# Altium project ESE516_ExampleBaseProject_V1.PrjPcb
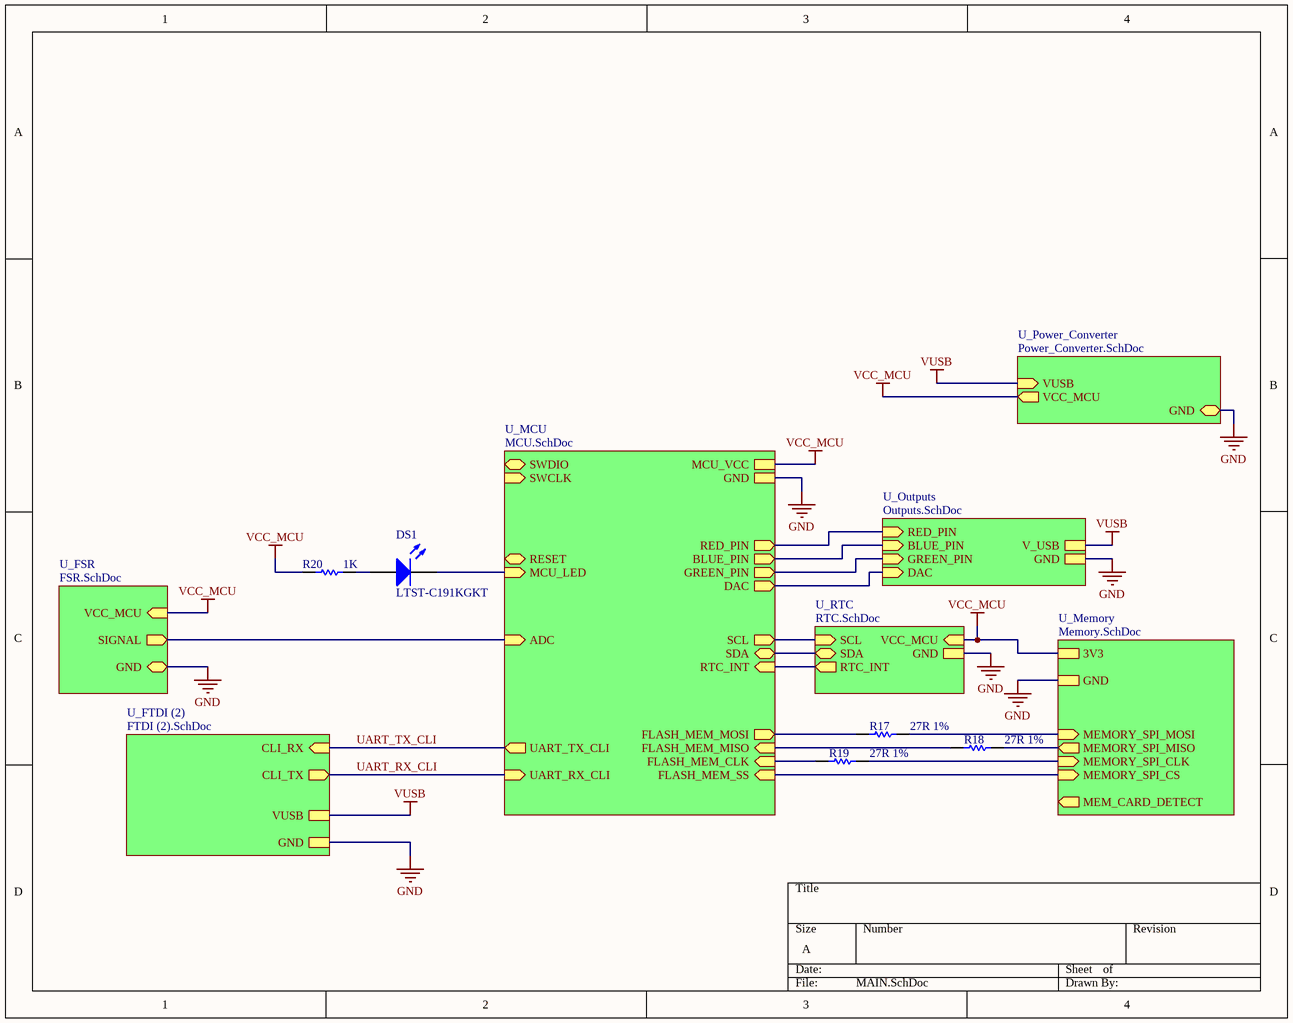
[diagram p0: MAIN.SchDoc]
8 sheets, 99 parts. Net scope: strictly hierarchical (ports join the sheet entries above them; power ports are local).
Board file: ESE516_BareBoardTemplate.PcbDoc
Sheets:
  MAIN.SchDoc
    U_MCU = MCU.SchDoc
    U_Memory = Memory.SchDoc
    U_RTC = RTC.SchDoc
    U_Outputs = Outputs.SchDoc
    U_Power_Converter = Power_Converter.SchDoc
    U_FSR = FSR.SchDoc
    U_FTDI (2) = FTDI (2).SchDoc

## Sheet MAIN.SchDoc
size A; DrawnBy: Eduardo

### Parts
DS1  LTST-C191KGKT  [LITE-ON-LTST-C191KRKT-2_V]
R17  27R 1%  [RESC0603(1608)_N]
R18  27R 1%  [RESC0603(1608)_N]
R19  27R 1%  [RESC0603(1608)_N]
R20  1K  [RESC0603(1608)_M]

### Sub-sheets
U_FSR = FSR.SchDoc: VCC_MCU (in), SIGNAL (out), GND (bidir)
U_FTDI (2) = FTDI (2).SchDoc: CLI_RX (in), CLI_TX (out), VUSB, GND
U_MCU = MCU.SchDoc: SWDIO (bidir), SWCLK (in), UART_TX_CLI (out), UART_RX_CLI (in), FLASH_MEM_SS (in), FLASH_MEM_CLK (in), FLASH_MEM_MISO (in), FLASH_MEM_MOSI (out), RESET (bidir), MCU_LED (in), MCU_VCC, GND, SDA (bidir), SCL (out), DAC (out), RED_PIN (out), GREEN_PIN (out), BLUE_PIN (out), ADC (in), RTC_INT (in)
U_Memory = Memory.SchDoc: MEMORY_SPI_MOSI (in), MEMORY_SPI_MISO (out), MEMORY_SPI_CLK (in), MEMORY_SPI_CS (in), MEM_CARD_DETECT (out), GND, 3V3
U_Outputs = Outputs.SchDoc: RED_PIN (in), BLUE_PIN (in), GREEN_PIN (in), DAC (in), V_USB, GND
U_Power_Converter = Power_Converter.SchDoc: VUSB (in), VCC_MCU (out), GND (bidir)
U_RTC = RTC.SchDoc: SCL (in), RTC_INT (out), SDA (bidir), VCC_MCU (in), GND

### Nets
GND: sheet U_MCU/GND, sheet U_Memory/GND, sheet U_RTC/GND, sheet U_Outputs/GND, sheet U_Power_Converter/GND, sheet U_FSR/GND, sheet U_FTDI (2)/GND
VCC_MCU: R20.1 ; sheet U_MCU/MCU_VCC, sheet U_Memory/3V3, sheet U_RTC/VCC_MCU, sheet U_Power_Converter/VCC_MCU, sheet U_FSR/VCC_MCU
VUSB: sheet U_Outputs/V_USB, sheet U_Power_Converter/VUSB, sheet U_FTDI (2)/VUSB
ADC: sheet U_MCU/ADC, sheet U_FSR/SIGNAL
BLUE_PIN: sheet U_MCU/BLUE_PIN, sheet U_Outputs/BLUE_PIN
DAC: sheet U_MCU/DAC, sheet U_Outputs/DAC
FLASH_MEM_SPI_SS: sheet U_MCU/FLASH_MEM_SS, sheet U_Memory/MEMORY_SPI_CS
GREEN_PIN: sheet U_MCU/GREEN_PIN, sheet U_Outputs/GREEN_PIN
MCU_LED: DS1.2(K) ; sheet U_MCU/MCU_LED
MEM_SPI_CLK: R19.2 ; sheet U_Memory/MEMORY_SPI_CLK
MEM_SPI_MISO: R18.2 ; sheet U_Memory/MEMORY_SPI_MISO
MEM_SPI_MOSI: R17.2 ; sheet U_Memory/MEMORY_SPI_MOSI
RED_PIN: sheet U_MCU/RED_PIN, sheet U_Outputs/RED_PIN
RTC_INT: sheet U_MCU/RTC_INT, sheet U_RTC/RTC_INT
SCL: sheet U_MCU/SCL, sheet U_RTC/SCL
SDA: sheet U_MCU/SDA, sheet U_RTC/SDA
SERCOM1_PAD2_SPI_MISO: R18.1 ; sheet U_MCU/FLASH_MEM_MISO
SERCOM1_PAD2_SPI_MOSI: R17.1 ; sheet U_MCU/FLASH_MEM_MOSI
SERCOM1_PAD3_SPI_SCK: R19.1 ; sheet U_MCU/FLASH_MEM_CLK
UART_RX_CLI: sheet U_MCU/UART_RX_CLI, sheet U_FTDI (2)/CLI_TX
UART_TX_CLI: sheet U_MCU/UART_TX_CLI, sheet U_FTDI (2)/CLI_RX
NetDS1_1: DS1.1(A) R20.2

### Library data of the parts
DS1 = CMP-2000-05198-1: Chip LED, Green, 574 nm, 40 pF, -55 to 85 degC, 2-Pin SMD, RoHS, Tape and Reel; Manufacturer: Lite-On; Rad Hardened: No; Emitting Color: YellowGreen; Product Height (mm): 0.55mm; Forward Voltage: 2.4V; Number of Elements: 1; Dominant Wave Length: 571nm; DELETED: Compliant; Viewing Angle: 130deg; High Brightness: Yes; Peak Wavelength: 574nm; Type: Uni-Color; Forward Current: 30mA; Product Length (mm): 1.6mm; Luminous Intensity: 35mcd; Test Current (It): 20mA; Chip Material: AlGaInP; Product Depth (mm): 0.8mm; Shape Type: Rectangular; Reverse Voltage: 5V; Power Dissipation: 75W; Pin Count: 2; Lens Dimensions: 1.1X0.8X0.37mm; Packaging: TapeandReel; Main Category: ChipLED; Operating Temperature Classification: Industrial; Package Type: ChipLed; Mounting: SurfaceMount; Lum Intensity: 35mcd; Operating Temp Range: -55Cto85C; Datasheet Version: Jan-07; Datasheet URL: http://download.siliconexpert.com/pdfs/2007/08/26/semi_b/manual/lot/ds/ltst-c191kgkt.pdf; Manufacturer URL: http://www.us.liteon.com/
R17-R19 = CMP-1012-00331-1: 27R 0.1W 1% 0603 (1608 Metric)  SMD; Case-EIA: 0603; Value: 27.00 Ohm; Case-Metric: 1608; Technology: SMT; Tolerance: 1 %; Power: 0.1 W
R20 = CMP-1012-00510-1: 1K 0.1W 1% 0603 (1608 Metric)  SMD; Case-Metric: 1608; Case-EIA: 0603; Value: 1000.00 Ohm; Technology: SMT; Tolerance: 1 %; Power: 0.1 W

## Sheet MCU.SchDoc
size A
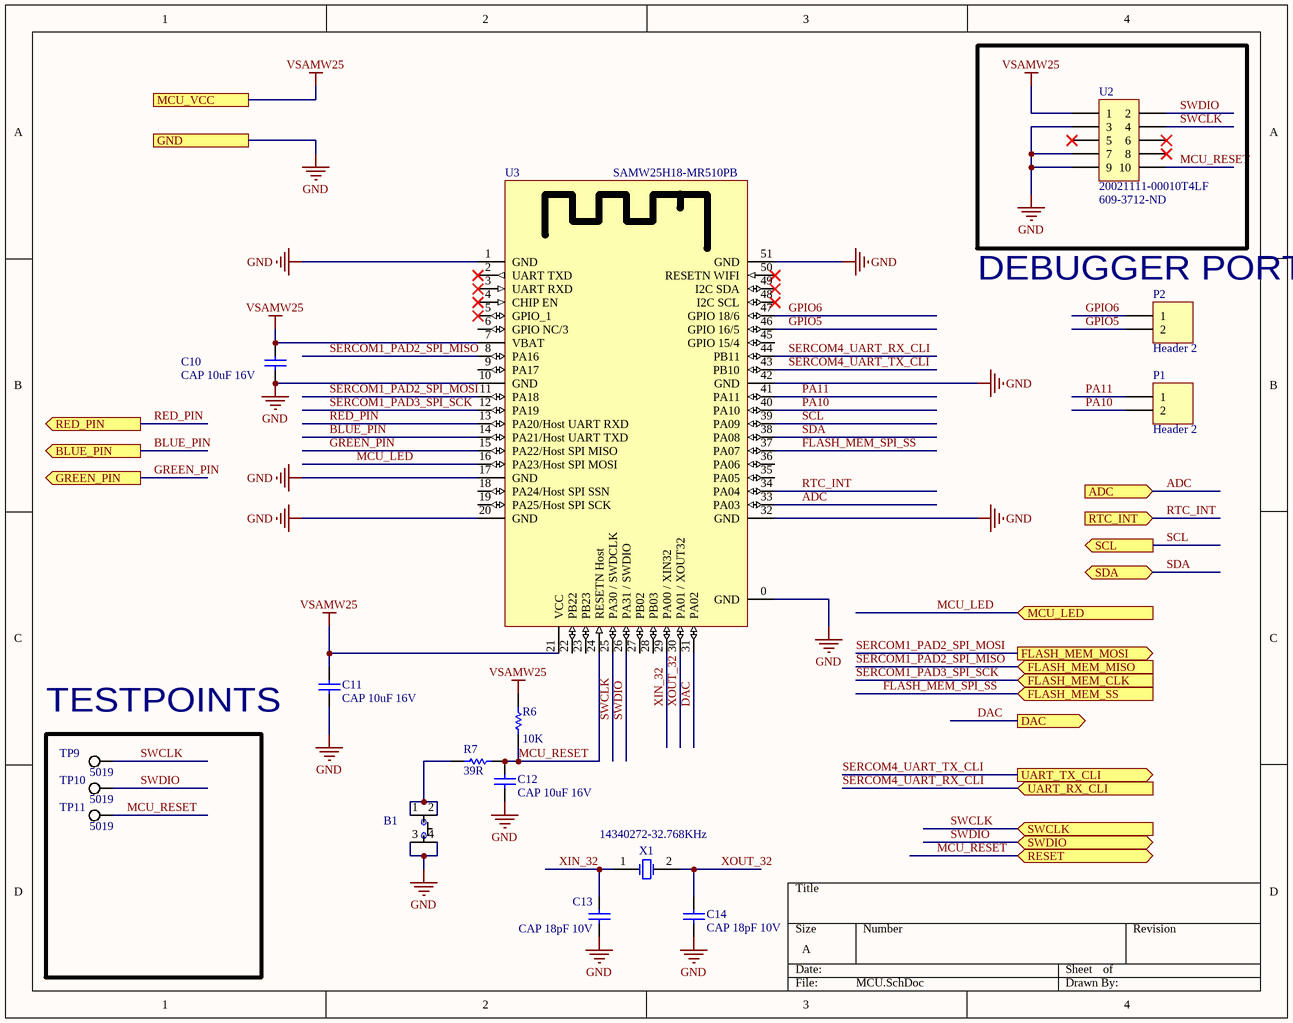
[diagram p1: MCU.SchDoc]

### Parts
B1  PTS810 SJK 250 SMTR LFS  [PTS810 SJK 250 SMTR LFS]  (value not drawn)
C10  CAP 10uF 16V  [CAPC0805(2012)145_L]
C11  CAP 10uF 16V  [CAPC0805(2012)145_L]
C12  CAP 10uF 16V  [CAPC0805(2012)145_L]
C13  CAP 18pF 10V  [CAPC0805(2012)75_L]
C14  CAP 18pF 10V  [CAPC0805(2012)75_L]
P1  Header 2  [HDR1X2]  (no BOM)
P2  Header 2  [HDR1X2]  (no BOM)
R6  value 10K  [J1-0603]
R7  39R  [RESC0805(2012)_N]
TP9  5019  [KSTN-5019_V]  (no BOM)
TP10  5019  [KSTN-5019_V]  (no BOM)
TP11  5019  [KSTN-5019_V]  (no BOM)
U2  20021111-00010T4LF  Supplier Part Number 1: 609-3712-ND  [20021111-00010T4LF]
U3  SAMW25H18-MR510PB  [SAMW25H18-MR510PB]
X1  14340272-32.768KHz  [ITTI-14340272-32.768KHz-2_V]

### Blocks framed on the sheet
TESTPOINTS: TP9-TP11

### Ports
ADC (in), BLUE_PIN (out), DAC (out), FLASH_MEM_CLK (in), FLASH_MEM_MISO (in), FLASH_MEM_MOSI (out), FLASH_MEM_SS (in), GND, GREEN_PIN (out), MCU_LED (in), MCU_VCC, RED_PIN (out), RESET (bidir), RTC_INT (in), SCL (out), SDA (bidir), SWCLK (in), SWDIO (bidir), UART_RX_CLI (in), UART_TX_CLI (out)

### Nets
GND: B1.3 B1.4 C10.1 C11.1 C12.1 C13.2 C14.2 U2.3 U2.7 U2.9 U3.0(GND) U3.1(GND) U3.10(GND) U3.17(GND) U3.20(GND) U3.32(GND) U3.42(GND) U3.51(GND) ; port GND
VSAMW25: C10.2 C11.2 R6.2 U2.1 U3.7(VBAT) U3.21(VCC) ; port MCU_VCC  [project net VCC_MCU]
ADC: U3.33(PA03) ; port ADC
BLUE_PIN: U3.14(PA21/Host_UART_TXD) ; port BLUE_PIN
DAC: U3.31(PA02) ; port DAC
FLASH_MEM_SPI_SS: U3.37(PA07) ; port FLASH_MEM_SS
GPIO5: P2.2 U3.46(GPIO_16/5)
GPIO6: P2.1 U3.47(GPIO_18/6)
GREEN_PIN: U3.15(PA22/Host_SPI_MISO) ; port GREEN_PIN
MCU_LED: U3.16(PA23/Host_SPI_MOSI) ; port MCU_LED
MCU_RESET: C12.2 R6.1 R7.1 TP11.1 U2.10 U3.24(RESETN_Host) ; port RESET
PA10: P1.2 U3.40(PA10)
PA11: P1.1 U3.41(PA11)
RED_PIN: U3.13(PA20/Host_UART_RXD) ; port RED_PIN
RTC_INT: U3.34(PA04) ; port RTC_INT
SCL: U3.39(PA09) ; port SCL
SDA: U3.38(PA08) ; port SDA
SERCOM1_PAD2_SPI_MISO: U3.8(PA16) ; port FLASH_MEM_MISO
SERCOM1_PAD2_SPI_MOSI: U3.11(PA18) ; port FLASH_MEM_MOSI
SERCOM1_PAD3_SPI_SCK: U3.12(PA19) ; port FLASH_MEM_CLK
SERCOM4_UART_RX_CLI: U3.44(PB11) ; port UART_RX_CLI  [project net UART_RX_CLI]
SERCOM4_UART_TX_CLI: U3.43(PB10) ; port UART_TX_CLI  [project net UART_TX_CLI]
SWCLK: TP9.1 U2.4 U3.25(PA30_/_SWDCLK) ; port SWCLK
SWDIO: TP10.1 U2.2 U3.26(PA31_/_SWDIO) ; port SWDIO
XIN_32: C13.1 U3.29(PA00_/_XIN32) X1.1(X1)
XOUT_32: C14.1 U3.30(PA01_/_XOUT32) X1.2(X2)
NetB1_1: B1.1 B1.2 R7.2

Not connected (* = marked no-connect by the designer): U2 5* 6* 8*; U3 2(UART_TXD)* 3(UART_RXD)* 4(CHIP_EN)* 5(GPIO_1)* 6(GPIO_NC/3) 9(PA17) 18(PA24/Host_SPI_SSN) 19(PA25/Host_SPI_SCK) 22(PB22) 23(PB23) 27(PB02) 28(PB03) 35(PA05) 36(PA06) 45(GPIO_15/4) 48(I2C_SCL)* 49(I2C_SDA)* 50(RESETN_WIFI)*

### Notes on the sheet
- (near P2) DEBUGGER PORT

### Library data of the parts
B1 = PTS810 SJK 250 SMTR LFS: SWITCH TACTILE SPST-NO 0.05A 16V Tactile Switch SPST-NO Top Actuated Surface Mount; Manufacturer: ITT /  C&K Components; Part # Aliases: Y97LT25B5DBFP; Operating Force: 2.6 N; Actuator: Oval; Current Rating: 50 mA; Voltage Rating DC: 16 VDC; Contact Form: SPST; Switch Function: OFF - (ON); Mounting Direction: Straight; Stem Height: 2.5 mm; Brand: C&K Components; Travel: 0.15 mm; Manufacturer Part Number: PTS810SJK250SMTRLFS; Product Category: Tactile Switches; RoHS: Details; Termination Style: J Form Lead; Mounting Style: SMD/SMT; Color: White; Packaging: Reel; Contact Plating: Silver; Operating Temperature Range: - 40 C to + 85 C; Series: PTS810; Factory Pack Quantity: 2900; ComponentLink1URL: https://datasheet.ciiva.com/18514/pts810-4mar13-18514061.pdf; ComponentLink1Description: https://datasheet.ciiva.com/18514/pts810-4mar13-18514061.pdf; ComponentLink2URL: https://datasheet.ciiva.com/18514/pts810-4mar13-18514062.pdf; ComponentLink2Description: https://datasheet.ciiva.com/18514/pts810-4mar13-18514062.pdf; ComponentLink3URL: https://datasheet.ciiva.com/18514/pts810-4mar13-18514063.pdf; ComponentLink3Description: https://datasheet.ciiva.com/18514/pts810-4mar13-18514063.pdf; Supplier 1: Digi-Key; Supplier Part Number 1: CKN10503CT-ND
C10-C12 = CMP-1036-04927-1: CAP 10uF 16V ±10% 0805 (2012 Metric) Thickness 1.45mm SMD; Case-EIA: 0805; Tolerance: Â±10%; Case-Metric: 2012; Rated Voltage: 16 V; Technology: SMT; Value: 10uF; Max Thickness: 1.45 mm
C13 C14 = CMP-1036-01106-1: CAP 18pF 10V ±1% 0805 (2012 Metric) Thickness 0.75mm SMD; Tolerance: Â±1%; Case-Metric: 2012; Case-EIA: 0805; Technology: SMT; Rated Voltage: 10 V; Value: 18pF; Max Thickness: 0.75 mm
P1 P2 = Header 2: Header, 2-Pin; LatestRevisionDate: 17-Jul-2002; LatestRevisionNote: Re-released for DXP Platform.; Publisher: Altium Limited
R6 = Res1: Resistor; Published: 8-Jun-2000; LatestRevisionDate: 17-Jul-2002; LatestRevisionNote: Re-released for DXP Platform.; PackageReference: AXIAL-0.3; Publisher: Altium Limited; PackageDescription: Axial Device, Thru-Hole; 2 Leads; 0.3 in Pin Spacing
R7 = CMP-1013-00040-1: 39R 0.125W 5% 0805 (2012 Metric)  SMD; Value: 39.00 Ohm; Case-EIA: 0805; Case-Metric: 2012; Technology: SMT; Power: 0.125 W; Tolerance: 5 %
TP9-TP11 = CMP-1672-00008-1: Test Point, 1 Position SMD, RoHS, Tape and Reel; ComponentLink1Description: Manufacturer URL; Package Quantity: 1000; DatasheetVersion: 03/2014; Packaging: Tape and Reel; ComponentLink2URL: http://www.keyelco.com/product-pdf.cfm?p=1357; ComponentLink1URL: http://www.keyelco.com/; Mount: Surface Mount; Contact Plating: Silver; PackageDescription: 1-Pin Surface Mount Device, Body 3.81 x 2.03 mm; Pins: 1; RoHSCompliant: True; Mounting Technology: Surface Mount; ComponentLink2Description: Datasheet; PackageReference: 5019
U2 = 20021111-00010T4LF: CONN HEADER 10POS UNSHD VERT T/H; Manufacturer: Amphenol / FCI; Stack Height: 2.5 mm; Number of Positions / Contacts: 10; Brand: FCI; Pitch: 1.27 mm; Mounting Angle: Vertical; Current Rating: 10 A; Mating Post Length: 3.05 mm; Voltage Rating: 125 V; Manufacturer Part Number: 20021111-00010T4LF; Mounting Style: Through Hole; Product Category: Headers & Wire Housings; RoHS: Details; Series: Minitek; Product Type: Headers; Type: Unshrouded; Number of Positions: 10; Number of Rows: 2; Contact Plating: Gold; Housing Material: Plastic; Termination Style: Through Hole; Contact Material: Nickel; Packaging: Tube; Factory Pack Quantity: 93; Termination Post Length: 2.3 mm; ComponentLink1URL: https://datasheet.ciiva.com/1433/1079612-1433267.pdf; ComponentLink1Description: https://datasheet.ciiva.com/1433/1079612-1433267.pdf; ComponentLink2URL: https://datasheet.ciiva.com/409/20021111-409158.pdf; ComponentLink2Description: https://datasheet.ciiva.com/409/20021111-409158.pdf; ComponentLink3URL: https://datasheet.ciiva.com/5131/20021111-5131386.pdf; ComponentLink3Description: https://datasheet.ciiva.com/5131/20021111-5131386.pdf; ComponentLink4URL: https://datasheet.ciiva.com/9465/20021111-9465402.pdf; ComponentLink4Description: https://datasheet.ciiva.com/9465/20021111-9465402.pdf; Supplier 1: Digi-Key
U3 = SAMW25H18-MR510PB: RF TXRX MODULE WIFI TRACE ANT; Manufacturer: Atmel; Manufacturer Part Number: ATSAMW25H18-MR510PB; Protocol: 802.11b/g/n; Frequency: 2.4GHz; Data Rate: 65Mbps; Power - Output: 17dBm; Sensitivity: -95.5dBm; Serial Interfaces: SPI, UART; Antenna Type: Integrated, Trace; Memory Size: 256kB Flash, 32kB SRAM; Voltage - Supply: 2.7 V ~ 4.2 V; Category: RF/IF and RFID; Family: RF Transceiver Modules; Series: Xplained Pro; Packaging: Tray; RF Family/Standard: WiFi; Modulation: -; Current - Receiving: -; Current - Transmitting: -; Mounting Type: Surface Mount; Operating Temperature: -40°C ~ 85°C; Package / Case: Module; ComponentLink1URL: http://www.atmel.com/devices/ATSAMW25.aspx; ComponentLink1Description: http://www.atmel.com/devices/ATSAMW25.aspx; ComponentLink2URL: http://www.farnell.com/datasheets/1965115.pdf; ComponentLink2Description: http://www.farnell.com/datasheets/1965115.pdf; Supplier 1: Digikey; Stock 1: 120; Pricing 1: 1=19.14 (USD); Supplier Part Number 1: ATSAMW25H18-MR510PB-ND
X1 = CMP-0463-00001-2: Crystal, 32.768 KHz, -40 to 85 degC, 3.2 x 1.5 x 0.9 mm SMD; Manufacturer: ITTI; Load Capacitance: 12.5 pF; Frequency Tolerance: +/-20 ppm; Drive Level: 1 max. uw; Nominal Frequency: 32.768KHz; Mounting Technology: Surface Mount; Operating temperature: -40 to 85 degC; PartNumber: 14340272-32.768KHz; ComponentLink1URL: http://www.itti-co.com; ComponentLink1Description: Manufacturer URL; PackageReference: 14340272-32.768KHz-2; PackageDescription: 2-Pin Hand Drawn, Body 3.2 x 1.5mm, Pitch 2.5 mm

## Sheet Memory.SchDoc
size A
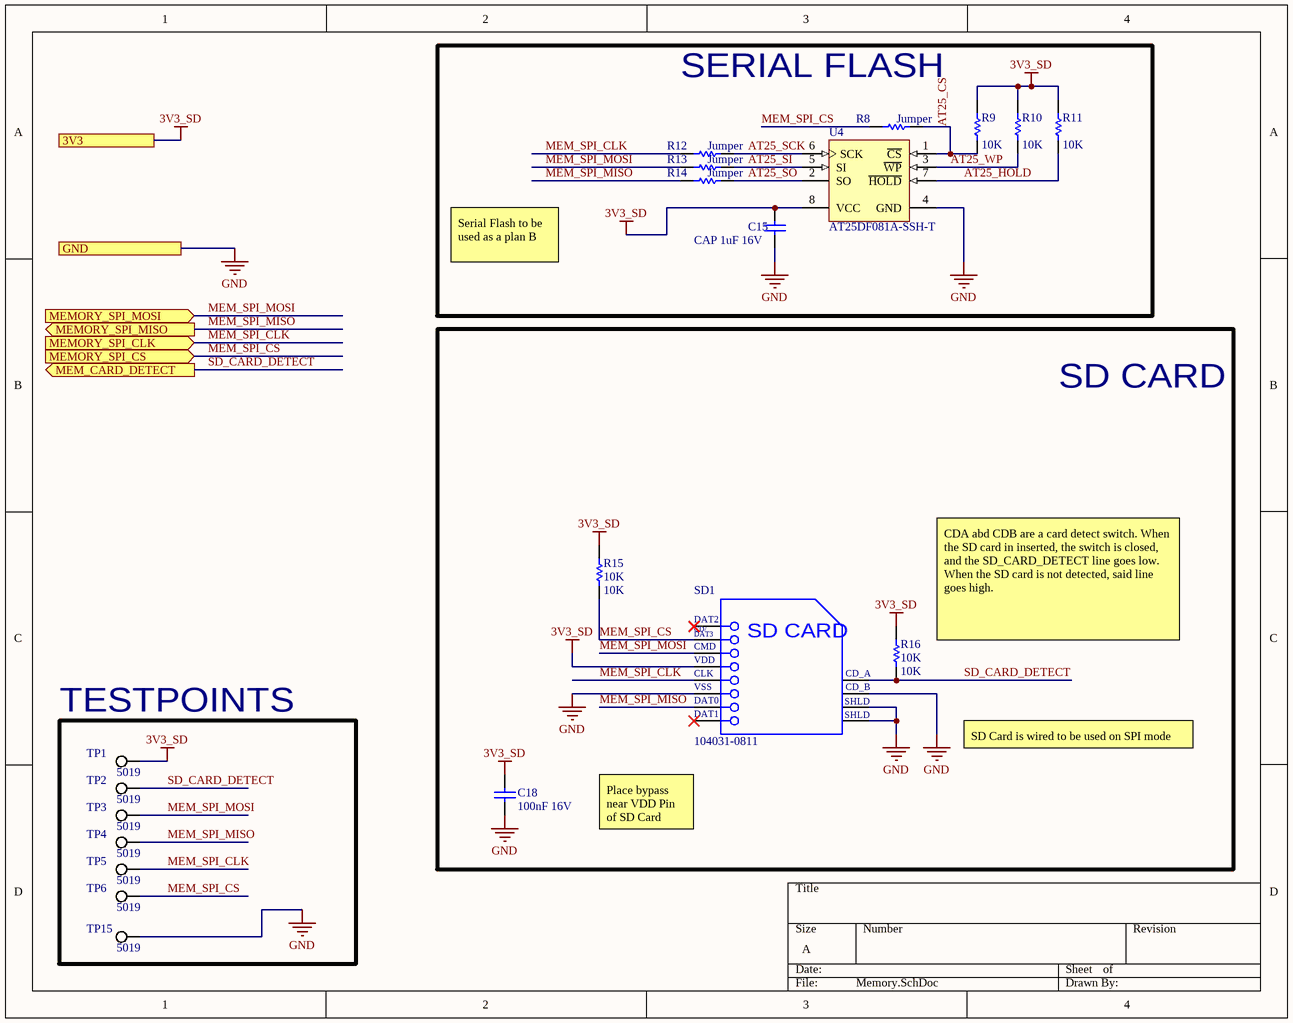
[diagram p2: Memory.SchDoc]

### Parts
C15  CAP 1uF 16V  [CAPC0603(1608)100_N]
C18  100nF 16V  [CAPC0603(1608)100_N]
R8  Jumper  [RESC0603(1608)_N]
R9  value 10K  [J1-0603]
R10  value 10K  [J1-0603]
R11  value 10K  [J1-0603]
R12  Jumper  [RESC0603(1608)_N]
R13  Jumper  [RESC0603(1608)_N]
R14  Jumper  [RESC0603(1608)_N]
R15  10K  [J1-0603]
R16  10K  [J1-0603]
SD1  104031-0811  [MOLX-104031-0811_V]
TP1  5019  [KSTN-5019_V]  (no BOM)
TP2  5019  [KSTN-5019_V]  (no BOM)
TP3  5019  [KSTN-5019_V]  (no BOM)
TP4  5019  [KSTN-5019_V]  (no BOM)
TP5  5019  [KSTN-5019_V]  (no BOM)
TP6  5019  [KSTN-5019_V]  (no BOM)
TP15  5019  [KSTN-5019_V]  (no BOM)
U4  AT25DF081A-SSH-T  [AT25DF081A-SSH-T]

### Blocks framed on the sheet
SERIAL FLASH: C15 R8-R14 U4
SD CARD: C18 R15 R16 SD1
TESTPOINTS: TP1-TP6 TP15

### Ports
3V3, GND, MEM_CARD_DETECT (out), MEMORY_SPI_CLK (in), MEMORY_SPI_CS (in), MEMORY_SPI_MISO (out), MEMORY_SPI_MOSI (in)

### Nets
3V3_SD: C15.2 C18.2 R9.2 R10.2 R11.2 R15.2 R16.2 SD1.4(VDD) TP1.1 U4.8(VCC) ; port 3V3  [project net VCC_MCU]
GND: C15.1 C18.1 SD1.6(VSS2) SD1.10(CD_B) SD1.11(SHLD1) SD1.12(SHLD2) TP15.1 U4.4(GND) ; port GND
AT25_CS: R8.2 R9.1 U4.1(~{CS})
AT25_HOLD: R11.1 U4.7(~{HOLD})
AT25_SCK: R12.2 U4.6(SCK)
AT25_SI: R13.2 U4.5(SI)
AT25_SO: R14.2 U4.2(SO)
AT25_WP: R10.1 U4.3(~{WP})
MEM_SPI_CLK: R12.1 SD1.5(CLK) TP5.1 ; port MEMORY_SPI_CLK
MEM_SPI_CS: R8.1 R15.1 SD1.2(CMD) TP6.1 ; port MEMORY_SPI_CS  [project net FLASH_MEM_SPI_SS]
MEM_SPI_MISO: R14.1 SD1.7(DAT0) TP4.1 ; port MEMORY_SPI_MISO
MEM_SPI_MOSI: R13.1 SD1.3(VSS1) TP3.1 ; port MEMORY_SPI_MOSI
SD_CARD_DETECT: R16.1 SD1.9(CD_A) TP2.1 ; port MEM_CARD_DETECT

Not connected (* = marked no-connect by the designer): SD1 1(CD/DAT3)* 8(DAT1)*

### Notes on the sheet
- Serial Flash to be used as a plan B
- (near R16) CDA abd CDB are a card detect switch. When the SD card in inserted, the switch is closed, and the SD_CARD_DETECT line goes low. When the SD card is not detected, said line goes high.
- SD Card is wired to be used on SPI mode
- Place bypass near VDD Pin of SD Card
- (in symbol CMP-2000-05825-1) DAT2; CD/; DAT3; SD CARD; VSS; SHLD

### Library data of the parts
C15 = CMP-1035-02737-1: CAP 1uF 16V ±10% 0603 (1608 Metric) Thickness 1mm SMD; Case-Metric: 1608; Tolerance: Â±10%; Case-EIA: 0603; Rated Voltage: 16 V; Max Thickness: 1 mm; Technology: SMT; Value: 1uF
C18 = CMP-1035-02584-1: CAP 100nF 16V ±10% 0603 (1608 Metric) Thickness 1mm SMD; Tolerance: Â±10%; Case-EIA: 0603; Case-Metric: 1608; Technology: SMT; Max Thickness: 1 mm; Value: 100nF; Rated Voltage: 16 V
R8 R12-R14 = CMP-1012-00001-1: Jumper 0603 (1608 Metric); Case-Metric: 1608; Value: 0.00 Ohm; Power: None; Case-EIA: 0603; Technology: SMT; Tolerance: None
R9-R11 R15 R16 = Res1: Resistor; Published: 8-Jun-2000; LatestRevisionDate: 17-Jul-2002; LatestRevisionNote: Re-released for DXP Platform.; PackageReference: AXIAL-0.3; Publisher: Altium Limited; PackageDescription: Axial Device, Thru-Hole; 2 Leads; 0.3 in Pin Spacing
  R15 R16: Value: 10K
SD1 = CMP-2000-05825-1: Micro SD Card, RA, -25 to 85 degC, 8-Pin SMD, RoHS, Tape and Reel; Voltage Rating: 10VAC/DC; Number of Contacts: 8; Insertion - Extraction Style: Push-Pull; Pitch: 1.1mm; Mating Cycles: 10000; Brand: Molex; Current Rating: 500mA; Manufacturer URL: http://www.molex.com/; Card Type: microSD; Mounting Type: Standard; Height: 1.42mm; Mounting Technology: SurfaceMount; Contact Plating: Gold; Product Category: MemoryCardConnectors; Package Description: 8-Pin Surface Mount Device, Body 11.95 x 11.4 mm, Pitch 1.1 mm; Datasheet URL: http://www.molex.com/pdm_docs/sd/1040310811_sd.pdf; Termination Style: SMD; Length: 11.4mm; Housing Material: LiquidCrystalPolymer(LCP); Orientation: RightAngle; RoHS: True; Contact Material: PhosphorBronze; Datasheet Version: Rev. E, 04/2006; Packaging: Reel; Manufacturer: Molex; Series: 104031; Product: CardConnectors; Number of Rows: 1Row; Package Reference: 104031-0811
TP1-TP6 TP15 = CMP-1672-00008-1: as TP9 on sheet MCU; ComponentLink1Description: Manufacturer URL; Package Quantity: 1000; DatasheetVersion: 03/2014; Packaging: Tape and Reel; ComponentLink2URL: http://www.keyelco.com/product-pdf.cfm?p=1357; ComponentLink1URL: http://www.keyelco.com/; Mount: Surface Mount; Contact Plating: Silver; PackageDescription: 1-Pin Surface Mount Device, Body 3.81 x 2.03 mm; Pins: 1; RoHSCompliant: True; Mounting Technology: Surface Mount; ComponentLink2Description: Datasheet; PackageReference: 5019
U4 = AT25DF081A-SSH-T: IC FLASH 8MBIT 100MHZ 8SOIC; Manufacturer: Adesto Technologies; Memory Size: 8M (4096 pages x 256 bytes); Interface: SPI, RapidS; Voltage - Supply: 2.7 V ~ 3.6 V; Rad Hard: No; Manufacturer Part Number: AT25DF081A-SSH-T; RoHS: RoHS Compliant; Category: Integrated Circuits (ICs); Packaging: Cut Tape (CT); Part Status: Active; Format - Memory: FLASH; Memory Type: FLASH; Speed: 100MHz; Operating Temperature: -40°C ~ 85°C (TC); Package / Case: 8-SOIC (0.154", 3.90mm Width); Supplier Device Package: 8-SOIC; ComponentLink1URL: http://www.adestotech.com/wp-content/uploads/doc8715.pdf; ComponentLink1Description: http://www.adestotech.com/wp-content/uploads/doc8715.pdf; Supplier 1: Digikey; Stock 1: 2550; Pricing 1: 1=1.18, 10=1.081, 25=1.0516, 50=1.0462, 100=0.9352, 250=0.9324, 500=0.9185, 1000=0.8791 (USD); Package: 8SOIC; ComponentLink2URL: https://datasheet.ciiva.com/14084/doc8715-14084443.pdf; ComponentLink2Description: https://datasheet.ciiva.com/14084/doc8715-14084443.pdf; ComponentLink3URL: https://datasheet.ciiva.com/26910/getdatasheetpartid-730210-26910875.pdf; ComponentLink3Description: https://datasheet.ciiva.com/26910/getdatasheetpartid-730210-26910875.pdf; ComponentLink4URL: https://datasheet.ciiva.com/12251/doc8715-12251468.pdf; ComponentLink4Description: https://datasheet.ciiva.com/12251/doc8715-12251468.pdf; Supplier Part Number 1: 1265-1166-1-ND

## Sheet RTC.SchDoc
size A
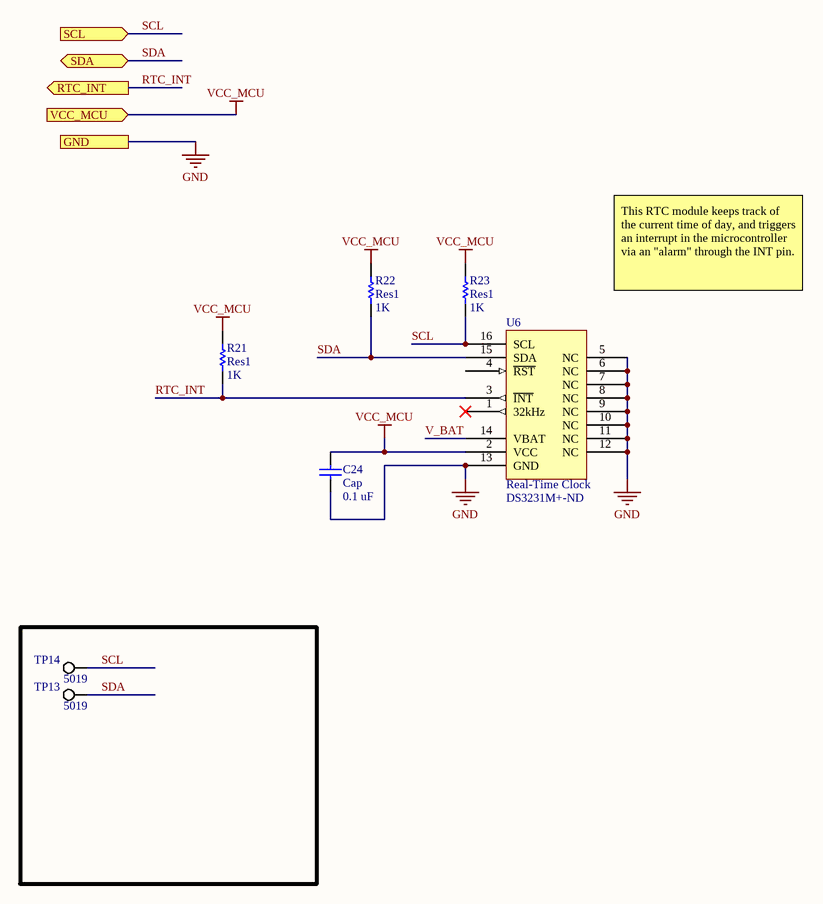
[diagram p3: RTC.SchDoc]

### Parts
C24  Cap  value 0.1 uF  [1608[0603]]
R21  Res1  value 1K  [J1-0603]
R22  Res1  value 1K  [J1-0603]
R23  Res1  value 1K  [J1-0603]
TP13  5019  [KSTN-5019_V]  (no BOM)
TP14  5019  [KSTN-5019_V]  (no BOM)
U6  Real-Time Clock  Supplier Part Number 1: DS3231M+-ND  [DS3231 SO16]

### Ports
GND, RTC_INT (out), SCL (in), SDA (bidir), VCC_MCU (in)

### Nets
GND: C24.2 U6.5(NC) U6.6(NC) U6.7(NC) U6.8(NC) U6.9(NC) U6.10(NC) U6.11(NC) U6.12(NC) U6.13(GND) ; port GND
VCC_MCU: C24.1 R21.2 R22.2 R23.2 U6.2(VCC) ; port VCC_MCU
RTC_INT: R21.1 U6.3(~{INT}) ; port RTC_INT
SCL: R23.1 TP14.1 U6.16(SCL) ; port SCL
SDA: R22.1 TP13.1 U6.15(SDA) ; port SDA
V_BAT: U6.14(VBAT)

Not connected (* = marked no-connect by the designer): U6 1(32kHz)* 4(~{RST})

### Notes on the sheet
- This RTC module keeps track of the current time of day, and triggers an interrupt in the microcontroller via an "alarm" through the INT pin.

### Library data of the parts
C24 = Cap: Capacitor; Published: 8-Jun-2000; LatestRevisionDate: 17-Jul-2002; LatestRevisionNote: Re-released for DXP Platform.; PackageReference: RAD-0.3; Publisher: Altium Limited; PackageDescription: Radial Cap, Thru-Hole; 2 Leads; 0.3 in Pin Spacing
R21-R23 = Res1: Resistor; Published: 8-Jun-2000; LatestRevisionDate: 17-Jul-2002; LatestRevisionNote: Re-released for DXP Platform.; PackageReference: AXIAL-0.3; Publisher: Altium Limited; PackageDescription: Axial Device, Thru-Hole; 2 Leads; 0.3 in Pin Spacing
TP13 TP14 = CMP-1672-00008-1: as TP9 on sheet MCU; ComponentLink1Description: Manufacturer URL; Package Quantity: 1000; DatasheetVersion: 03/2014; Packaging: Tape and Reel; ComponentLink2URL: http://www.keyelco.com/product-pdf.cfm?p=1357; ComponentLink1URL: http://www.keyelco.com/; Mount: Surface Mount; Contact Plating: Silver; PackageDescription: 1-Pin Surface Mount Device, Body 3.81 x 2.03 mm; Pins: 1; RoHSCompliant: True; Mounting Technology: Surface Mount; ComponentLink2Description: Datasheet; PackageReference: 5019
U6 = DS3231: Extremely Accurate I2C-Integrated RTC/TCXO/Crystal; Manufacturer: Maxim; Manufacturer Part Number: DS3231M+; Time Format: HH:MM:SS; Operating Supply Voltage: 3.3V; Max Supply Voltage: 5.5V; Min Supply Voltage: 2.3V; Interface: 2-Wire,I2C,Serial; Date Format: YY-MM-DD-dd; Supplier 1: Digi-Key; RoHS: Yes; Stock 1: 65; Pricing 1: 1 = 7.98000, 10 = 7.58100, 25 = 6.99000, 50 = 6.64060, 100 = 6.01000, 250 = 5.70952, 1000 = 4.27822 (USD); Mount: Surface Mount; Case/Package: SOIC; Number of Pins: 16; Min Operating Temperature: -40°C; Max Operating Temperature: 85°C; Logic Function: Clock; Package Quantity: 46; Packaging: Rail/Tube; Radiation Hardening: No; ComponentLink1URL: http://www.mouser.com/ds/2/256/DS3231M-35560.pdf?src-supplier=Mouser; ComponentLink1Description: http://www.mouser.com/ds/2/256/DS3231M-35560.pdf?src-supplier=Mouser; ComponentLink2URL: http://datasheets.maximintegrated.com/en/ds/DS3231M.pdf?src-supplier=Digi-Key; ComponentLink2Description: http://datasheets.maximintegrated.com/en/ds/DS3231M.pdf?src-supplier=Digi-Key; ComponentLink3URL: http://datasheet.iiic.cc/maxim/DS3231M_.pdf?src-supplier=IIIC; ComponentLink3Description: http://datasheet.iiic.cc/maxim/DS3231M_.pdf?src-supplier=IIIC

## Sheet Outputs.SchDoc
size A
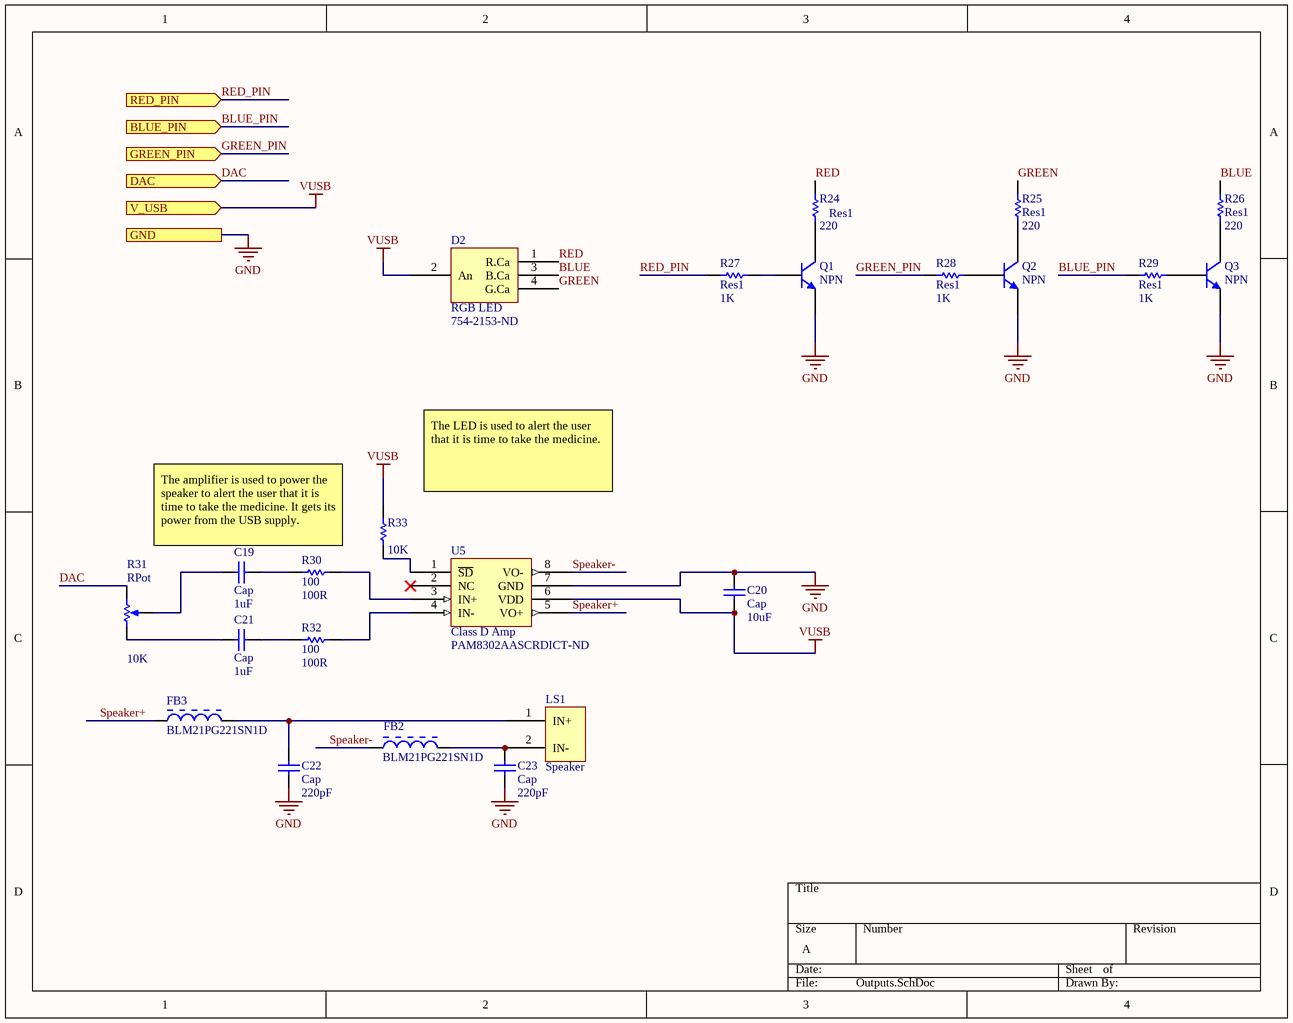
[diagram p4: Outputs.SchDoc]

### Parts
C19  Cap  value 1uF  [C0805]
C20  Cap  value 10uF  [1608[0603]]
C21  Cap  value 1uF  [C0805]
C22  Cap  value 220pF  [1608[0603]]
C23  Cap  value 220pF  [1608[0603]]
D2  RGB LED  Supplier Part Number 1: 754-2153-ND  [WP154A4 LED]
FB2  BLM21PG221SN1D  [MURA-BLM21-B20-CHIP-2_V1]
FB3  BLM21PG221SN1D  [MURA-BLM21-B20-CHIP-2_V1]
LS1  Speaker  [Speaker]
Q1  NPN  [SOT23_L]
Q2  NPN  [SOT23_L]
Q3  NPN  [SOT23_L]
R24  Res1  value 220  [6-0805_L]
R25  Res1  value 220  [6-0805_L]
R26  Res1  value 220  [6-0805_L]
R27  Res1  value 1K  [J1-0603]
R28  Res1  value 1K  [J1-0603]
R29  Res1  value 1K  [J1-0603]
R30  100  value 100R  [6-0805_L]
R31  RPot  value 10K  [VR4]
R32  100  value 100R  [6-0805_L]
R33  value 10K  [J1-0603]
U5  Class D Amp  Supplier Part Number 1: PAM8302AASCRDICT-ND  [PAM8302 SO-8]

### Ports
BLUE_PIN (in), DAC (in), GND, GREEN_PIN (in), RED_PIN (in), V_USB (in)

### Nets
GND: C20.2 C22.2 C23.1 Q1.3(E) Q2.3(E) Q3.3(E) U5.7(GND) ; port GND
VUSB: C20.1 D2.2(An) R33.2 U5.6(VDD) ; port V_USB
BLUE: D2.3(B.Ca) R26.2
BLUE_PIN: R29.1 ; port BLUE_PIN
DAC: R31.2(BOT) ; port DAC
GREEN: D2.4(G.Ca) R25.2
GREEN_PIN: R28.1 ; port GREEN_PIN
RED: D2.1(R.Ca) R24.2
RED_PIN: R27.1 ; port RED_PIN
Speaker+: FB3.1 U5.5(VO+)
Speaker-: FB2.1 U5.8(VO-)
NetC19_1: C19.1 R31.3(TAP)
NetC19_2: C19.2 R30.1
NetC21_1: C21.1 R31.1(TOP)
NetC21_2: C21.2 R32.1
NetC22_1: C22.1 FB3.2 LS1.1(IN+)
NetC23_2: C23.2 FB2.2 LS1.2(IN-)
NetQ1_1: Q1.1(C) R24.1
NetQ1_2: Q1.2(B) R27.2
NetQ2_1: Q2.1(C) R25.1
NetQ2_2: Q2.2(B) R28.2
NetQ3_1: Q3.1(C) R26.1
NetQ3_2: Q3.2(B) R29.2
NetR30_2: R30.2 U5.3(IN+)
NetR32_2: R32.2 U5.4(IN-)
NetR33_1: R33.1 U5.1(~{SD})

Not connected (* = marked no-connect by the designer): U5 2(NC)*

### Notes on the sheet
- (near R33) The LED is used to alert the user that it is time to take the medicine.
- The amplifier is used to power the speaker to alert the user that it is time to take the medicine. It gets its power from the USB supply.

### Library data of the parts
C19-C23 = Cap: Capacitor; Published: 8-Jun-2000; LatestRevisionDate: 17-Jul-2002; LatestRevisionNote: Re-released for DXP Platform.; PackageReference: RAD-0.3; Publisher: Altium Limited; PackageDescription: Radial Cap, Thru-Hole; 2 Leads; 0.3 in Pin Spacing
D2 = WP154A4: RGB LED (THT); Manufacturer: Kingbright; Manufacturer Part Number: WP154A4SEJ3VBDZGC/CA; Supplier 1: Digi-Key; Stock 1: 3880; Pricing 1: 1 = 2.05000, 10 = 1.81400, 25 = 1.34560, 100 = 1.17000, 250 = 1.05300, 500 = 0.93602, 1000 = 0.80439, 2500 = 0.76051, 5000 = 0.73126 (USD)
FB2 FB3 = CMP-0686-00610-2: Chip Ferrite Bead for Power Lines, 220 Ohm, 2000 mA, -55 to 125 degC, 2 x 1.25 x 1.05 mm SMD, Tape and Reel; Manufacturer: Murata; DC Resistance: 0.045 Ohm Max.; Impedance (at 100 MHz): 220 Ohm +/- 25%; Rated Current: 2000 mA; PartNumber: BLM21PG221SN1D; Mounting Technology: Surface Mount; DatasheetVersion: 08/2013; ComponentLink3URL: http://www.murata.com/products/catalog/pdf/c31e.pdf; ComponentLink1URL: http://www.murata.com/; ComponentLink1Description: Manufacturer URL; ComponentLink2URL: http://www.murata.com/products/catalog/pdf/c31e.pdf; PackageDescription: 2-Pin Chip, Body 2 x 1.25 mm; ComponentLink3Description: Package Specification; Operating Temperature Range: -55 to 125 degC; Packing: Tape and Reel; ComponentLink2Description: Datasheet; PackageReference: BLM21_H1050-2
LS1 = Adafruit 3" Speaker: Speaker 3" Diameter 4 Ohm 3 Watt
Q1-Q3 = NPN: NPN Bipolar Transistor; pin to pad: 2>3 3>2; Published: 8-Jun-2000; LatestRevisionDate: 17-Jul-2002; LatestRevisionNote: Re-released for DXP Platform.; PackageReference: TO-226-AA; Publisher: Altium Limited; PackageDescription: TO, Flat Index; 3 In-Line, Axial Leads; Body Dia. 4.8mm; Leads 0.55 x 0.51 mm (max); Code_JEDEC: TO-226-AA
R24-R29 R33 = Res1: Resistor; Published: 8-Jun-2000; LatestRevisionDate: 17-Jul-2002; LatestRevisionNote: Re-released for DXP Platform.; PackageReference: AXIAL-0.3; Publisher: Altium Limited; PackageDescription: Axial Device, Thru-Hole; 2 Leads; 0.3 in Pin Spacing
R30 R32 = Res1: Resistor (100); Published: 8-Jun-2000; LatestRevisionDate: 17-Jul-2002; LatestRevisionNote: Re-released for DXP Platform.; PackageReference: AXIAL-0.3; Publisher: Altium Limited; PackageDescription: Axial Device, Thru-Hole; 2 Leads; 0.3 in Pin Spacing
R31 = RPot: Potentiometer; Sim Note: Enter the Resistance value and the set point into parameter fields.; Set Position: 0.5; Published: 8-Jun-2000; LatestRevisionDate: 17-Jul-2002; LatestRevisionNote: Re-released for DXP Platform.; PackageReference: VR5; Publisher: Altium Limited; PackageDescription: Variable Resistor, Thru-Hole; 3 Leads
U5 = PAM8302A: 2.5W Filterless Class-D Mono Audio Amplifier; Manufacturer: Diodes; Manufacturer Part Number: PAM8302AADCR; Voltage Gain: 24dB; Min Supply Voltage: 2V; Max Supply Voltage: 5.5V; Power Supply Rejection Ratio (PSRR): 50dB; Nominal Supply Current: 8mA; Number of Channels: 1; Operating Supply Current: 4mA; Supply Type: Single; RoHS: Yes; Mount: Surface Mount; Case/Package: SOP; Number of Pins: 8; Min Operating Temperature: -40°C; Max Operating Temperature: 85°C; Package Quantity: 2500; Packaging: Tape and Reel; Max Output Power: 2.5W; Radiation Hardening: No; ComponentLink1URL: http://www.diodes.com/datasheets/PAM8302A.pdf?src-supplier=Avnet; ComponentLink1Description: http://www.diodes.com/datasheets/PAM8302A.pdf?src-supplier=Avnet; ComponentLink2URL: https://www.diodes.com/assets/Datasheets/PAM8302A.pdf?src-supplier=Digi-Key; ComponentLink2Description: https://www.diodes.com/assets/Datasheets/PAM8302A.pdf?src-supplier=Digi-Key; Supplier 1: Digi-Key; Stock 1: 1058; Pricing 1: 1 = 0.63000, 10 = 0.54100, 100 = 0.40380, 500 = 0.31724, 1000 = 0.24514 (USD); Weight: 0.004938oz; Output Power: 2.5W; Lead Free: Lead Free; ComponentLink3URL: http://www.mouser.com/ds/2/115/PAM8302A-247351.pdf?src-supplier=Mouser; ComponentLink3Description: http://www.mouser.com/ds/2/115/PAM8302A-247351.pdf?src-supplier=Mouser

## Sheet Power_Converter.SchDoc
size A
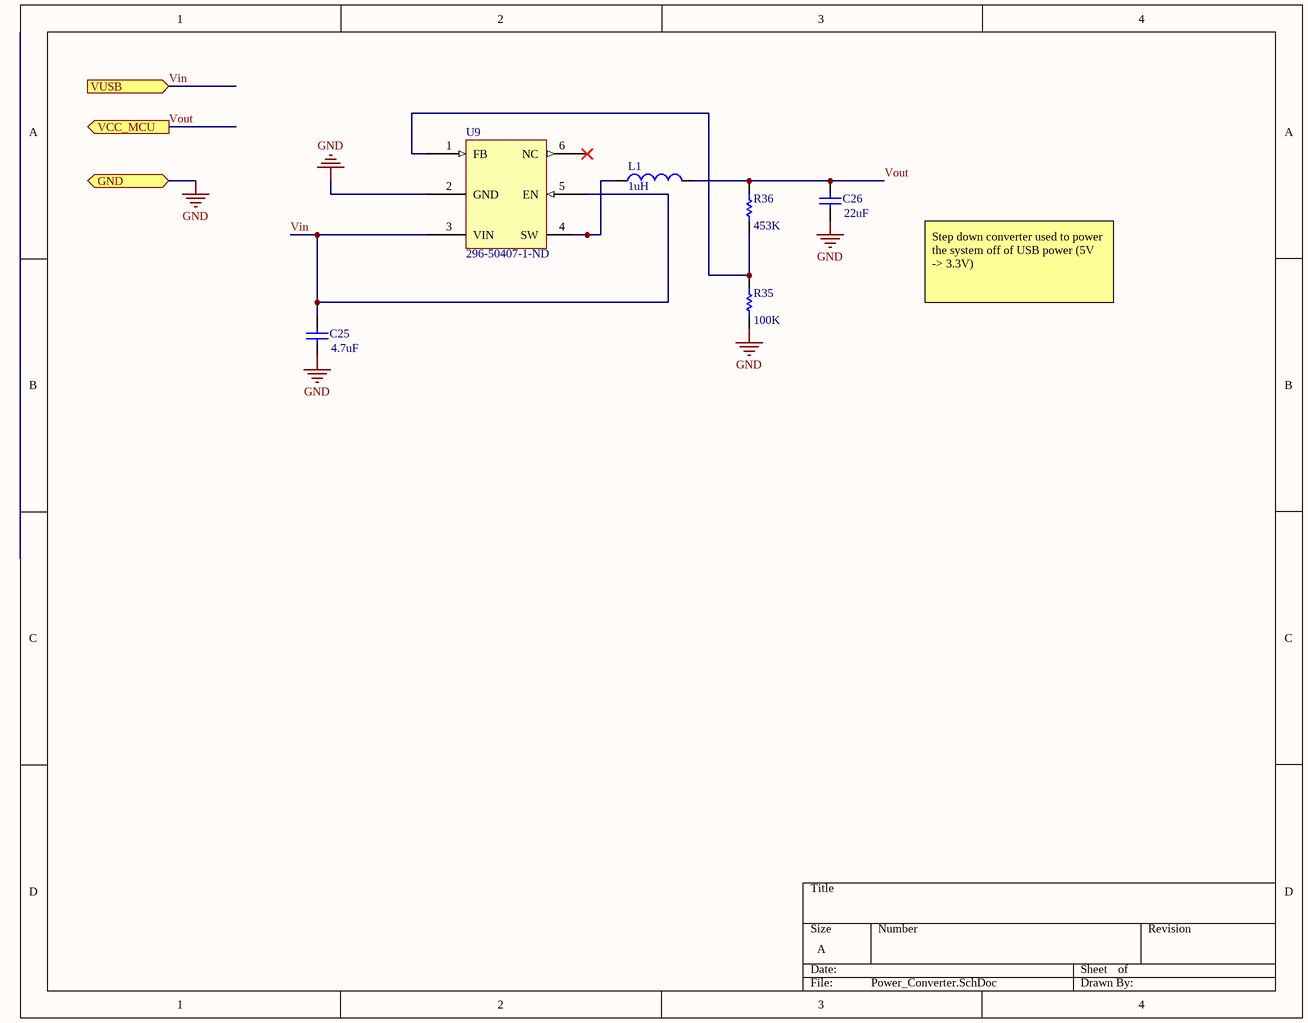
[diagram p5: Power_Converter.SchDoc]

### Parts
C25  value 4.7uF  [1608[0603]]  (hidden comment: Cap)
C26  value 22uF  [1608[0603]]  (hidden comment: Cap)
L1  value 1uH  [DFE252012F]  (hidden comment: Inductor)
R35  value 100K  [0402]  (hidden comment: Res1)
R36  value 453K  [6-0805_L]  (hidden comment: Res1)
U9  Supplier Part Number 1: 296-50407-1-ND  [TLV62568-SOT563]  (hidden comment: TLV62568DRL)

### Ports
GND (bidir), VCC_MCU (out), VUSB (in)

### Nets
GND: C25.1 C26.1 R35.1 U9.2(GND) ; port GND
Vin: C25.2 U9.3(VIN) U9.5(EN) ; port VUSB  [project net VUSB]
Vout: C26.2 L1.2 R36.2 ; port VCC_MCU  [project net VCC_MCU]
NetL1_1: L1.1 U9.4(SW)
NetR35_2: R35.2 R36.1 U9.1(FB)

Not connected (* = marked no-connect by the designer): U9 6(NC)*

### Notes on the sheet
- Step down converter used to power the system off of USB power (5V -> 3.3V)

### Library data of the parts
C25 = Cap: 4.7 uF 10V 0603; Published: 8-Jun-2000; LatestRevisionDate: 17-Jul-2002; LatestRevisionNote: Re-released for DXP Platform.; PackageReference: RAD-0.3; Publisher: Altium Limited; PackageDescription: Radial Cap, Thru-Hole; 2 Leads; 0.3 in Pin Spacing
C26 = Cap: Capacitor; Published: 8-Jun-2000; LatestRevisionDate: 17-Jul-2002; LatestRevisionNote: Re-released for DXP Platform.; PackageReference: RAD-0.3; Publisher: Altium Limited; PackageDescription: Radial Cap, Thru-Hole; 2 Leads; 0.3 in Pin Spacing
L1 = Inductor: Code_IEC: 1005; Published: 8-Jun-2000; LatestRevisionDate: 29-May-2009; LatestRevisionNote: IPC-7351 Footprint Added.; PackageReference: 0402-A; Publisher: Altium Limited; PackageDescription: Chip Inductor; Code_JEITA: 0402
R35 R36 = Res1: Resistor; Published: 8-Jun-2000; LatestRevisionDate: 17-Jul-2002; LatestRevisionNote: Re-released for DXP Platform.; PackageReference: AXIAL-0.3; Publisher: Altium Limited; PackageDescription: Axial Device, Thru-Hole; 2 Leads; 0.3 in Pin Spacing
U9 = TLV62568ADRL: This is a buck/boost converter designed by Texas Instruments; Manufacturer Part Number: TLV62568ADRLR; Supplier 1: Digi-Key; Manufacturer: Texas Instruments; Stock 1: 2339; Pricing 1: 1 = 1.14000, 10 = 1.01500, 100 = 0.79120, 500 = 0.65364, 1000 = 0.51603 (USD)

## Sheet FSR.SchDoc
size A
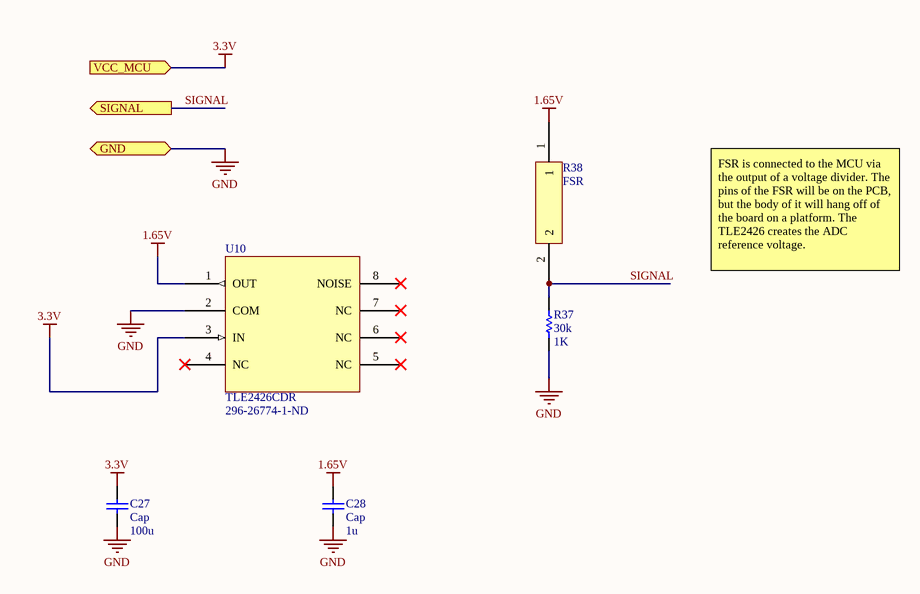
[diagram p6: FSR.SchDoc]

### Parts
C27  Cap  value 100u  [C0805]
C28  Cap  value 1u  [C0805]
R37  30k  value 1K  [6-0805_L]
R38  FSR  [HDR1X2H]
U10  TLE2426CDR  Supplier Part Number 1: 296-26774-1-ND  [TLE2426CDR]

### Ports
GND (bidir), SIGNAL (out), VCC_MCU (in)

### Nets
1.65V: C28.2 R38.1 U10.1(OUT)
3.3V: C27.2 U10.3(IN) ; port VCC_MCU  [project net VCC_MCU]
GND: C27.1 C28.1 R37.2 U10.2(COM) ; port GND
SIGNAL: R37.1 R38.2 ; port SIGNAL  [project net ADC]

Not connected (* = marked no-connect by the designer): U10 4(NC)* 5(NC)* 6(NC)* 7(NC)* 8(NOISE)*

### Notes on the sheet
- FSR is connected to the MCU via the output of a voltage divider. The pins of the FSR will be on the PCB, but the body of it will hang off of the board on a platform. The TLE2426 creates the ADC reference voltage.

### Library data of the parts
C27 C28 = Cap: Capacitor; Published: 8-Jun-2000; LatestRevisionDate: 17-Jul-2002; LatestRevisionNote: Re-released for DXP Platform.; PackageReference: RAD-0.3; Publisher: Altium Limited; PackageDescription: Radial Cap, Thru-Hole; 2 Leads; 0.3 in Pin Spacing
R37 = Res1: Resistor; Published: 8-Jun-2000; LatestRevisionDate: 17-Jul-2002; LatestRevisionNote: Re-released for DXP Platform.; PackageReference: AXIAL-0.3; Publisher: Altium Limited; PackageDescription: Axial Device, Thru-Hole; 2 Leads; 0.3 in Pin Spacing
R38 = FSR-1075-406: Force Sensing Resistor
U10 = TLE2426: Rail Splitter IC; Manufacturer: Texas Instruments; Max Input Voltage: 40V; Output Voltage: 20V; Max Output Current: 20mA; Min Output Voltage: 2V; Temperature Coefficient: 35ppm/°C; Reference Type: Adjustable,Ground Reference (Virtual); Tolerance: 1%; Operating Supply Current: 400uA; Output Type: Adjustable; Supplier 1: Digi-Key; Manufacturer Part Number: TLE2426CDR; RoHS: Yes; Stock 1: 17506; Pricing 1: 1 = 2.14000, 10 = 1.91900, 100 = 1.54230, 500 = 1.26716, 1000 = 1.04993 (USD); Mount: Surface Mount; Case/Package: SOIC; Number of Pins: 8; Weight: 0.002677oz; Min Operating Temperature: -55°C; Max Operating Temperature: 125°C; Packaging: Tape and Reel; Package Quantity: 1; Max Output Voltage: 20V; Output Current: 20mA; Reference Voltage: 20V; Length: 4.9mm; Height: 1.58mm; Width: 3.91mm; Radiation Hardening: No; Lead Free: Lead Free; REACH SVHC: No SVHC; ComponentLink1URL: http://www.ti.com/lit/ds/symlink/tle2426.pdf?src-supplier=Digi-Key; ComponentLink1Description: http://www.ti.com/lit/ds/symlink/tle2426.pdf?src-supplier=Digi-Key; ComponentLink2URL: http://www.ti.com/general/docs/lit/getliterature.tsp?genericPartNumber=TLE2426&&fileType=pdf&src-supplier=Element14; ComponentLink2Description: http://www.ti.com/general/docs/lit/getliterature.tsp?genericPartNumber=TLE2426&&fileType=pdf&src-supplier=Element14; ComponentLink3URL: http://www.ti.com/lit/ds/slos098d/slos098d.pdf?src-supplier=Avnet+Europe; ComponentLink3Description: http://www.ti.com/lit/ds/slos098d/slos098d.pdf?src-supplier=Avnet+Europe; ComponentLink4URL: http://www.farnell.com/datasheets/1362010.pdf?src-supplier=Farnell; ComponentLink4Description: http://www.farnell.com/datasheets/1362010.pdf?src-supplier=Farnell; ComponentLink5URL: http://www.ti.com/general/docs/lit/getliterature.tsp?genericPartNumber=TLE2426&&fileType=pdf&src-supplier=Avnet; ComponentLink5Description: http://www.ti.com/general/docs/lit/getliterature.tsp?genericPartNumber=TLE2426&&fileType=pdf&src-supplier=Avnet

## Sheet FTDI (2).SchDoc
size A
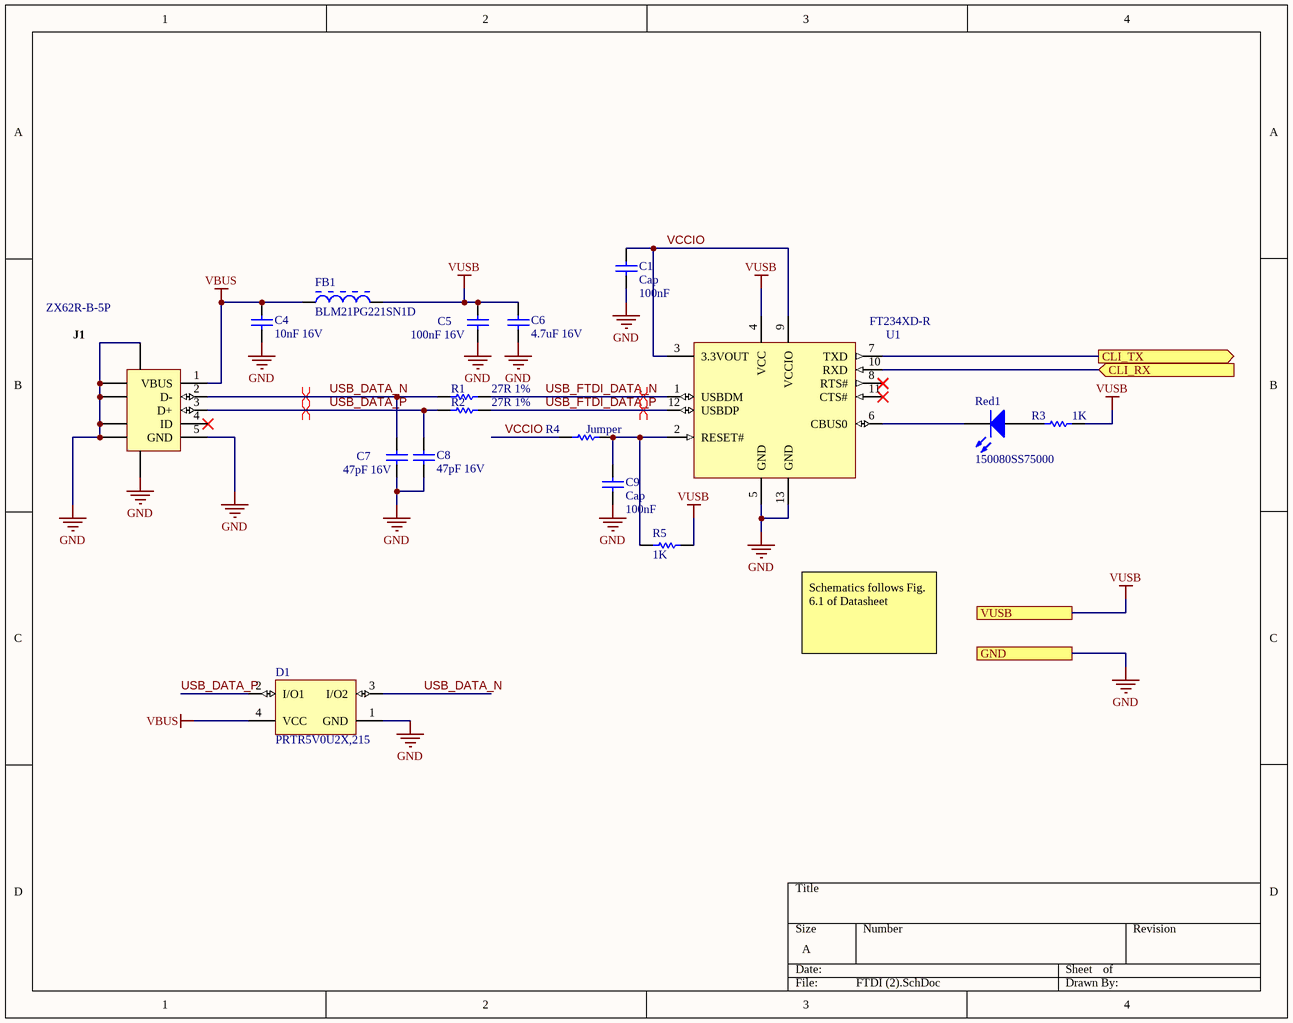
[diagram p7: FTDI (2).SchDoc]

### Parts
C1  Cap  value 100nF  [1608[0603]]
C4  10nF 16V  [CAPC0603(1608)100_L]
C5  100nF 16V  [CAPC0603(1608)100_N]
C6  4.7uF 16V  [CAPC0805(2012)145_N]
C7  47pF 16V  [CAPC0603(1608)100_L]
C8  47pF 16V  [CAPC0603(1608)100_L]
C9  Cap  value 100nF  [1608[0603]]
D1  PRTR5V0U2X,215  [NXP-SOT143B-4_V]
FB1  BLM21PG221SN1D  [MURA-BLM21-B20-CHIP-2_V1]
J1  ZX62R-B-5P  [HIRO-ZX62R-B-5P_V]
R1  27R 1%  [RESC0603(1608)_N]
R2  27R 1%  [RESC0603(1608)_N]
R3  1K  [RESC0603(1608)_M]
R4  Jumper  [RESC0603(1608)_N]
R5  1K  [RESC0603(1608)_M]
Red1  150080SS75000  [0805_A]
U1  FT234XD-R  [DFN-12_V]

### Ports
CLI_RX (in), CLI_TX (out), GND, VUSB

### Nets
GND: C1.1 C4.1 C5.1 C6.1 C7.1 C8.1 C9.1 D1.1(GND) J1.5(GND) J1.6(SHLD) J1.7(SHLD) J1.8(SHLD) J1.9(SHLD) J1.10(SHLD) J1.11(SHLD) U1.5(GND) U1.13(GND) ; port GND
VBUS: C4.2 D1.4(VCC) FB1.1 J1.1(VBUS)
VUSB: C5.2 C6.2 FB1.2 R3.2 R5.1 U1.4(VCC) ; port VUSB
UART_RX_CLI: U1.7(TXD) ; port CLI_TX
UART_TX_CLI: U1.10(RXD) ; port CLI_RX
USB_DATA_N: C7.2 D1.3(I/O2) J1.2(D-) R1.1
USB_DATA_P: C8.2 D1.2(I/O1) J1.3(D+) R2.1
USB_FTDI_DATA_N: R1.2 U1.1(USBDM)
USB_FTDI_DATA_P: R2.2 U1.12(USBDP)
VCCIO: C1.2 R4.1 U1.3(3.3VOUT) U1.9(VCCIO)
NetC9_2: C9.2 R4.2 R5.2 U1.2(RESET#)
NetR3_1: R3.1 Red1.2(A)
NetRed1_1: Red1.1(K) U1.6(CBUS0)

Not connected (* = marked no-connect by the designer): J1 4(ID)*; U1 8(RTS#)* 11(CTS#)*

### Layout directives
differential pair: USB_DATA_N, USB_DATA_P, USB_FTDI_DATA_N, USB_FTDI_DATA_P

### Notes on the sheet
- Schematics follows Fig. 6.1 of Datasheet

### Library data of the parts
C1 C9 = Cap: Capacitor; Published: 8-Jun-2000; LatestRevisionDate: 17-Jul-2002; LatestRevisionNote: Re-released for DXP Platform.; PackageReference: RAD-0.3; Publisher: Altium Limited; PackageDescription: Radial Cap, Thru-Hole; 2 Leads; 0.3 in Pin Spacing
C4 = CMP-1035-02311-1: CAP 10nF 16V ±10% 0603 (1608 Metric) Thickness 1mm SMD; Case-EIA: 0603; Case-Metric: 1608; Tolerance: Â±10%; Rated Voltage: 16 V; Value: 10nF; Max Thickness: 1 mm; Technology: SMT
C5 = CMP-1035-02584-1: as C18 on sheet Memory; Technology: SMT; Max Thickness: 1 mm; Value: 100nF; Rated Voltage: 16 V
C6 = CMP-1036-04889-1: CAP 4.7uF 16V ±10% 0805 (2012 Metric) Thickness 1.45mm SMD; Case-EIA: 0805; Case-Metric: 2012; Tolerance: Â±10%; Technology: SMT; Value: 4.7uF; Rated Voltage: 16 V; Max Thickness: 1.45 mm
C7 C8 = CMP-1035-01048-1: CAP 47pF 16V ±0.5pF 0603 (1608 Metric) Thickness 1mm SMD; Case-EIA: 0603; Case-Metric: 1608; Tolerance: Â±0.5pF; Technology: SMT; Value: 47pF; Rated Voltage: 16 V; Max Thickness: 1 mm
D1 = CMP-2000-05285-1: Ultra Low Capacitance Double Rail-to-Rail ESD Protection Diode, 5.5 V, 1 pF, -40 to 85 degC, 4-Pin SOT143B, RoHS, Tape and Reel; Manufacturer: NXP Semiconductors; Capacitance Value: 16pF; Number of Elements: 1; Rad Hardened: No; Reverse Breakdown Voltage: 6V; Working Voltage (Max): 5.5V; Polarity: Uni-Directional; Configuration: Quad; Leakage Current: 0.1uA; Product Height (mm): 1mm; Suppressor Type: DiodeArrays; Product Length (mm): 3mm; Product Depth (mm): 1.4mm; ESD Protection Voltage: 8KV@ContactDisc; Package Type: SOT; Mounting: SurfaceMount; Packaging: TapeandReel; Datasheet Version: Rev. 02, 01/2008; Reverse Stand-off Voltage: 5.5V; Manufacturer URL: http://www.nxp.com/; Operating Temp Range: -40Cto85C; Operating Temperature Classification: Industrial; Working Voltage: 5.5V; Operating Temperature Min Deg. C: -40C; Datasheet URL: https://datasheet.ciiva.com/4479/prtr5v0u2x-102853-4479461.pdf; Leakage Current (Max): 0.1uA; Direction Type: Uni-Directional; Pin Count: 3+Tab; Operating Temperature Max Deg. C: 85C; Mounting Style: SurfaceMount; Package / Case: SOT
FB1 = CMP-0686-00610-2: as FB2 on sheet Outputs; PartNumber: BLM21PG221SN1D; Mounting Technology: Surface Mount; DatasheetVersion: 08/2013; ComponentLink3URL: http://www.murata.com/products/catalog/pdf/c31e.pdf; ComponentLink1URL: http://www.murata.com/; ComponentLink1Description: Manufacturer URL; ComponentLink2URL: http://www.murata.com/products/catalog/pdf/c31e.pdf; PackageDescription: 2-Pin Chip, Body 2 x 1.25 mm; ComponentLink3Description: Package Specification; Operating Temperature Range: -55 to 125 degC; Packing: Tape and Reel; ComponentLink2Description: Datasheet; PackageReference: BLM21_H1050-2
J1 = CMP-0031-00001-1: Connector; USBMicro-B,Reverse type, SMT; 5 Position; Right Angle; DatasheetVersion: 08/2010; Operating Temperature: -30 to 85 degC; Mounting Technology: Surface Mount; PartNumber: ZX62R-B-5P; PackageReference: ZX62R-B-5P; ComponentLink2URL: http://www.hirose.co.jp/cataloge_hp/e24200011.pdf; ComponentLink1URL: http://www.hirose.com/â€Ž; ComponentLink2Description: Datasheet; PackageDescription: 5-Pin USB Micro-B R/A Connector; ComponentLink1Description: Manufacturer URL
R1 R2 = CMP-1012-00331-1: as R17 on sheet MAIN; Technology: SMT; Tolerance: 1 %; Power: 0.1 W
R3 R5 = CMP-1012-00510-1: as R20 on sheet MAIN; Technology: SMT; Tolerance: 1 %; Power: 0.1 W
R4 = CMP-1012-00001-1: as R8 on sheet Memory; Technology: SMT; Tolerance: None
Red1 = CMP-1426-00010-1: SMD mono-color Chip LED, WL-SMCW, Super Red; Manufacturer: Wuerth Elektronik; PackageReference: 0805_A; ComponentLink2URL: http://katalog.we-online.com/led/datasheet/150080SS75000.pdf; ComponentLink1URL: http://www.we-online.com; Color: Super Red; ComponentLink2Description: Datasheet; ComponentLink1Description: Manufacturer URL; PartNumber: 150080SS75000
U1 = CMP-0248-00027-1: FT234XD USB to BASIC UART IC, -40 to +85 degC, 12-Pin DFN, Pb-Free, Tape and Reel; Manufacturer: FTDI; PackageReference: DFN-12; PackageVersion: Feb-13; DatasheetVersion: ver 1.1, Feb-2013; ComponentLink1URL: http://www.ftdichip.com/; PartNumber: FT234XD-R; ComponentLink2URL: http://www.ftdichip.com/Support/Documents/DataSheets/ICs/DS_FT234XD.pdf; ComponentLink1Description: Manufacturer URL; PackageDescription: 12-Pin Dual Flat No-Lead, 3 x 3 mm Body, 0.45 mm Pitch, Exposed Pad; ComponentLink2Description: Datasheet

## Nets that join several sheets
GND: MCU (18 pins), Memory (8 pins), RTC (10 pins), Outputs (7 pins), Power_Converter (C25.1 C26.1 R35.1 U9.2), FSR (C27.1 C28.1 R37.2 U10.2), FTDI (2) (17 pins)
VCC_MCU: MAIN (R20.1), MCU (6 pins), Memory (10 pins), RTC (5 pins), Power_Converter (C26.2 L1.2 R36.2), FSR (C27.2 U10.3)
VUSB: Outputs (C20.1 D2.2 R33.2 U5.6), Power_Converter (C25.2 U9.3 U9.5), FTDI (2) (6 pins)
ADC: MCU (U3.33), FSR (R37.1 R38.2)
BLUE_PIN: MCU (U3.14), Outputs (R29.1)
DAC: MCU (U3.31), Outputs (R31.2)
FLASH_MEM_SPI_SS: MCU (U3.37), Memory (R8.1 R15.1 SD1.2 TP6.1)
GREEN_PIN: MCU (U3.15), Outputs (R28.1)
MCU_LED: MAIN (DS1.2), MCU (U3.16)
MEM_SPI_CLK: MAIN (R19.2), Memory (R12.1 SD1.5 TP5.1)
MEM_SPI_MISO: MAIN (R18.2), Memory (R14.1 SD1.7 TP4.1)
MEM_SPI_MOSI: MAIN (R17.2), Memory (R13.1 SD1.3 TP3.1)
RED_PIN: MCU (U3.13), Outputs (R27.1)
RTC_INT: MCU (U3.34), RTC (R21.1 U6.3)
SCL: MCU (U3.39), RTC (R23.1 TP14.1 U6.16)
SDA: MCU (U3.38), RTC (R22.1 TP13.1 U6.15)
SERCOM1_PAD2_SPI_MISO: MAIN (R18.1), MCU (U3.8)
SERCOM1_PAD2_SPI_MOSI: MAIN (R17.1), MCU (U3.11)
SERCOM1_PAD3_SPI_SCK: MAIN (R19.1), MCU (U3.12)
UART_RX_CLI: MCU (U3.44), FTDI (2) (U1.7)
UART_TX_CLI: MCU (U3.43), FTDI (2) (U1.10)

## Assembly variants
SD_CARD: not fitted C15 R5 R8 R9 R10 R11 R12 R13 R14 U4